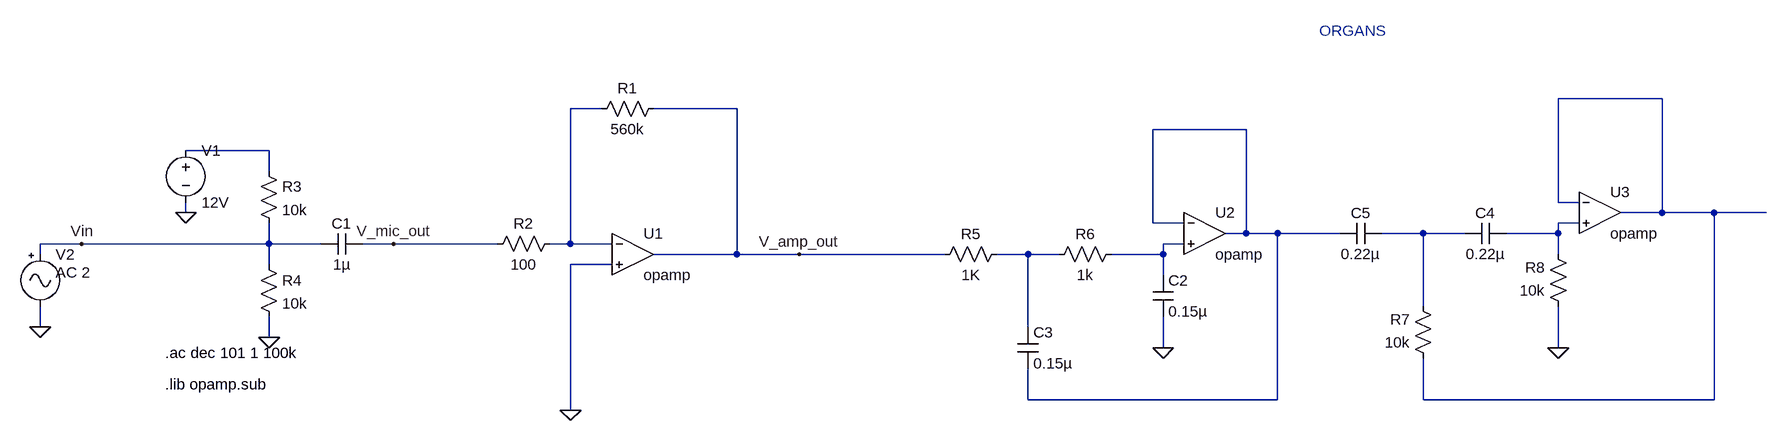
[diagram p0: schematic ORGANS_FILTER_AC.asc]
ORGANS_FILTER_AC.asc, the LTspice schematic file:
Version 4
SHEET 1 1972 680
WIRE 1808 -80 1648 -80
WIRE 176 -64 128 -64
WIRE 384 -64 256 -64
WIRE 1168 -32 1024 -32
WIRE -336 0 -464 0
WIRE -336 32 -336 0
WIRE 1648 80 1648 -80
WIRE 1680 80 1648 80
WIRE -464 96 -464 80
WIRE 1808 96 1808 -80
WIRE 1808 96 1744 96
WIRE 1888 96 1808 96
WIRE 1968 96 1888 96
WIRE 1024 112 1024 -32
WIRE 1072 112 1024 112
WIRE 1680 112 1648 112
WIRE 1168 128 1168 -32
WIRE 1168 128 1136 128
WIRE 1216 128 1168 128
WIRE 1312 128 1216 128
WIRE 1440 128 1376 128
WIRE 1504 128 1440 128
WIRE 1648 128 1648 112
WIRE 1648 128 1568 128
WIRE -624 144 -688 144
WIRE -336 144 -336 112
WIRE -336 144 -624 144
WIRE -256 144 -336 144
WIRE -144 144 -192 144
WIRE 16 144 -144 144
WIRE 128 144 128 -64
WIRE 128 144 96 144
WIRE 192 144 128 144
WIRE 1072 144 1040 144
WIRE -688 160 -688 144
WIRE 384 160 384 -64
WIRE 384 160 256 160
WIRE 480 160 384 160
WIRE 704 160 480 160
WIRE 832 160 784 160
WIRE 880 160 832 160
WIRE 1040 160 1040 144
WIRE 1040 160 960 160
WIRE 1648 160 1648 128
WIRE -336 176 -336 144
WIRE 192 176 128 176
WIRE 1040 192 1040 160
WIRE 1440 240 1440 128
WIRE -688 272 -688 240
WIRE 832 272 832 160
WIRE -336 288 -336 256
WIRE 1040 304 1040 256
WIRE 1648 304 1648 240
WIRE 832 384 832 336
WIRE 1216 384 1216 128
WIRE 1216 384 832 384
WIRE 1440 384 1440 320
WIRE 1888 384 1888 96
WIRE 1888 384 1440 384
WIRE 128 400 128 176
FLAG -336 288 0
FLAG -688 272 0
FLAG -464 96 0
FLAG -144 144 V_mic_out
FLAG -624 144 Vin
FLAG 128 400 0
FLAG 480 160 V_amp_out
FLAG 1040 304 0
FLAG 1648 304 0
SYMBOL res 272 -80 R90
WINDOW 0 0 56 VBottom 2
WINDOW 3 32 56 VTop 2
SYMATTR InstName R1
SYMATTR Value 560k
SYMBOL res 112 128 R90
WINDOW 0 0 56 VBottom 2
WINDOW 3 32 56 VTop 2
SYMATTR InstName R2
SYMATTR Value 100
SYMBOL res -352 16 R0
SYMATTR InstName R3
SYMATTR Value 10k
SYMBOL res -352 160 R0
SYMATTR InstName R4
SYMATTR Value 10k
SYMBOL cap -192 128 R90
WINDOW 0 0 32 VBottom 2
WINDOW 3 32 32 VTop 2
SYMATTR InstName C1
SYMATTR Value 1µ
SYMBOL voltage -464 -16 R0
WINDOW 123 0 0 Left 2
WINDOW 39 0 0 Left 2
SYMATTR InstName V1
SYMATTR Value 12V
SYMBOL Misc\\signal -688 144 R0
WINDOW 3 24 44 Left 2
WINDOW 123 24 44 Left 2
WINDOW 39 0 0 Left 2
SYMATTR Value ""
SYMATTR Value2 AC 2
SYMATTR InstName V2
SYMBOL Opamps\\opamp 224 96 R0
SYMATTR InstName U1
SYMBOL res 800 144 R90
WINDOW 0 0 56 VBottom 2
WINDOW 3 32 56 VTop 2
SYMATTR InstName R5
SYMATTR Value 1K
SYMBOL res 976 144 R90
WINDOW 0 0 56 VBottom 2
WINDOW 3 32 56 VTop 2
SYMATTR InstName R6
SYMATTR Value 1k
SYMBOL cap 1024 192 R0
SYMATTR InstName C2
SYMATTR Value 0.15µ
SYMBOL cap 816 272 R0
SYMATTR InstName C3
SYMATTR Value 0.15µ
SYMBOL Opamps\\opamp 1104 64 R0
SYMATTR InstName U2
SYMBOL res 1456 336 R180
WINDOW 0 36 76 Left 2
WINDOW 3 36 40 Left 2
SYMATTR InstName R7
SYMATTR Value 10k
SYMBOL res 1664 256 R180
WINDOW 0 36 76 Left 2
WINDOW 3 36 40 Left 2
SYMATTR InstName R8
SYMATTR Value 10k
SYMBOL cap 1568 112 R90
WINDOW 0 0 32 VBottom 2
WINDOW 3 32 32 VTop 2
SYMATTR InstName C4
SYMATTR Value 0.22µ
SYMBOL cap 1376 112 R90
WINDOW 0 0 32 VBottom 2
WINDOW 3 32 32 VTop 2
SYMATTR InstName C5
SYMATTR Value 0.22µ
SYMBOL Opamps\\opamp 1712 32 R0
SYMATTR InstName U3
TEXT -496 312 Left 2 !.ac dec 101 1 100k
TEXT -496 360 Left 2 !.lib opamp.sub
TEXT 1280 -184 Left 2 ;ORGANS

The netlist it stands for:
* ORGANS_FILTER_AC.asc
R1 V_amp_out N002 560k
R2 N002 V_mic_out 100
R3 N004 Vin 10k
R4 Vin 0 10k
C1 V_mic_out Vin 1µ
V1 N004 0 12V
V2 Vin 0 AC 2
XU1 N002 0 V_amp_out opamp Aol=100K GBW=10Meg  ; pins invin noninvin out
R5 N008 V_amp_out 1K
R6 N007 N008 1k
C2 N007 0 0.15µ
C3 N008 N003 0.15µ
XU2 N003 N007 N003 opamp Aol=100K GBW=10Meg  ; pins invin noninvin out
R7 N001 N006 10k
R8 0 N005 10k
C4 N005 N006 0.22µ
C5 N006 N003 0.22µ
XU3 N001 N005 N001 opamp Aol=100K GBW=10Meg  ; pins invin noninvin out
.ac dec 101 1 100k
.lib opamp.sub
* ORGANS
.backanno
.end